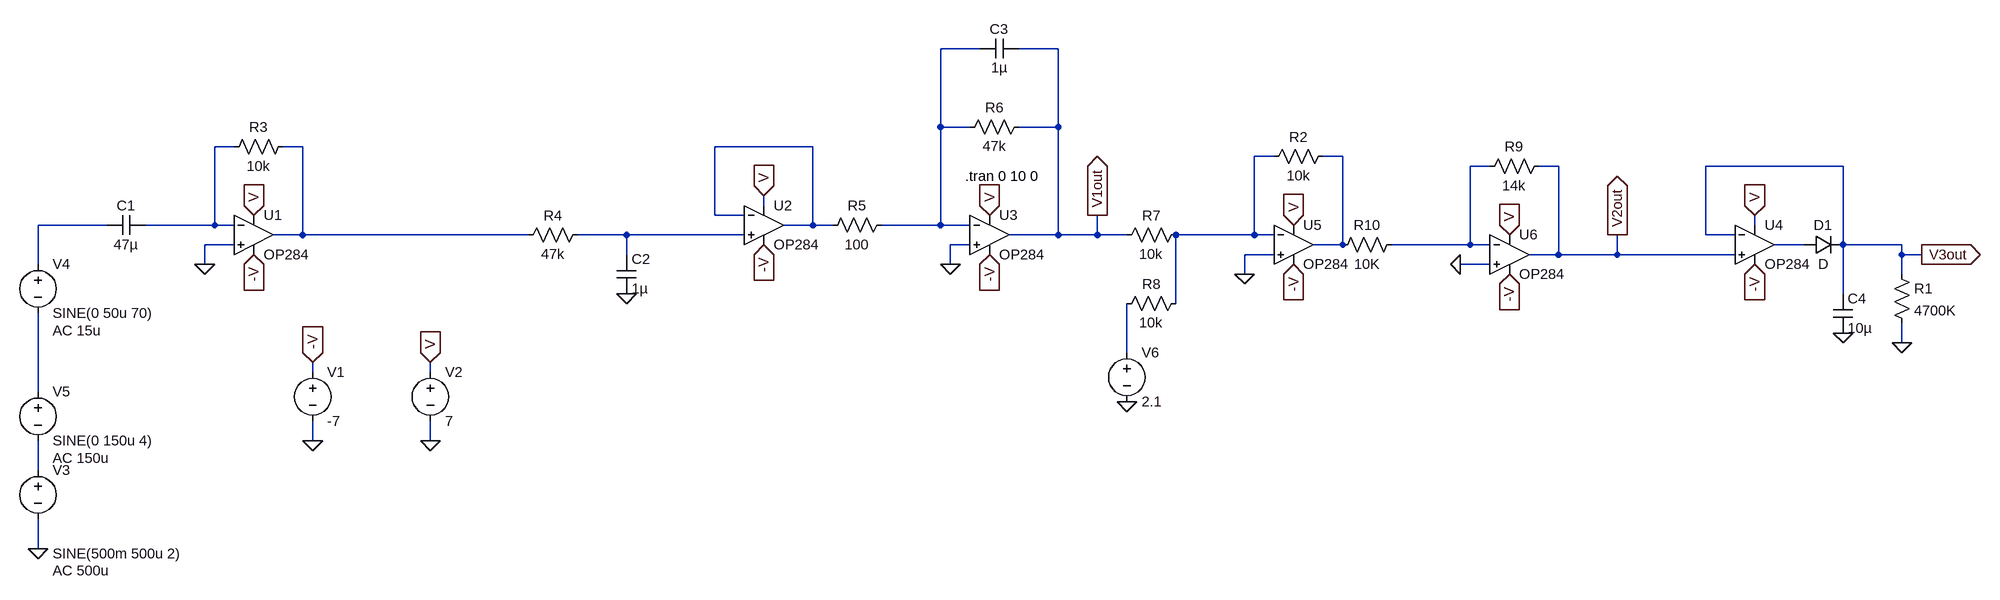
[diagram p0: schematic PPG.asc]
PPG.asc, the LTspice schematic file:
Version 4
SHEET 1 3920 992
WIRE 1440 -160 1376 -160
WIRE 1568 -160 1504 -160
WIRE 1376 -32 1376 -160
WIRE 1424 -32 1376 -32
WIRE 1568 -32 1568 -160
WIRE 1568 -32 1504 -32
WIRE 224 0 192 0
WIRE 336 0 304 0
WIRE 1168 0 1008 0
WIRE 1920 16 1888 16
WIRE 2032 16 2000 16
WIRE 2272 32 2240 32
WIRE 2384 32 2352 32
WIRE 2848 32 2624 32
WIRE 1088 96 1088 80
WIRE 1008 112 1008 0
WIRE 1056 112 1008 112
WIRE 16 128 -96 128
WIRE 192 128 192 0
WIRE 192 128 80 128
WIRE 224 128 192 128
WIRE 1168 128 1168 0
WIRE 1168 128 1120 128
WIRE 1200 128 1168 128
WIRE 1376 128 1376 -32
WIRE 1376 128 1280 128
WIRE 1424 128 1376 128
WIRE 2704 128 2704 112
WIRE 336 144 336 0
WIRE 336 144 288 144
WIRE 704 144 336 144
WIRE 864 144 784 144
WIRE 1056 144 864 144
WIRE 1568 144 1568 -32
WIRE 1568 144 1488 144
WIRE 1632 144 1632 112
WIRE 1632 144 1568 144
WIRE 1680 144 1632 144
WIRE 1888 144 1888 16
WIRE 1888 144 1760 144
WIRE 1920 144 1888 144
WIRE 2624 144 2624 32
WIRE 2672 144 2624 144
WIRE 224 160 176 160
WIRE 1424 160 1392 160
WIRE 2032 160 2032 16
WIRE 2032 160 1984 160
WIRE 2240 160 2240 32
WIRE 2240 160 2112 160
WIRE 2272 160 2240 160
WIRE 2784 160 2736 160
WIRE 2848 160 2848 32
WIRE 2944 160 2848 160
WIRE 864 176 864 144
WIRE 1920 176 1872 176
WIRE 2384 176 2384 32
WIRE 2384 176 2336 176
WIRE 2480 176 2480 144
WIRE 2480 176 2384 176
WIRE 2672 176 2480 176
WIRE 2944 176 2944 160
WIRE 2976 176 2944 176
WIRE -96 192 -96 128
WIRE 176 192 176 160
WIRE 1392 192 1392 160
WIRE 2272 192 2224 192
WIRE 1872 208 1872 176
WIRE 2944 208 2944 176
WIRE 2848 240 2848 160
WIRE 1760 256 1760 144
WIRE 2944 320 2944 288
WIRE 1680 336 1680 256
WIRE 352 368 352 352
WIRE 544 368 544 352
WIRE -96 400 -96 272
WIRE 352 480 352 448
WIRE 544 480 544 448
WIRE -96 528 -96 480
WIRE -96 656 -96 608
FLAG 176 192 0
FLAG 1088 80 V
IOPIN 1088 80 In
FLAG 1456 112 V
IOPIN 1456 112 In
FLAG 256 112 V
IOPIN 256 112 In
FLAG 1088 160 -V
IOPIN 1088 160 In
FLAG 1456 176 -V
IOPIN 1456 176 In
FLAG 256 176 -V
IOPIN 256 176 In
FLAG 352 480 0
FLAG 544 480 0
FLAG 544 352 V
IOPIN 544 352 In
FLAG 352 352 -V
IOPIN 352 352 In
FLAG -96 656 0
FLAG 864 240 0
FLAG 2704 112 V
IOPIN 2704 112 In
FLAG 2704 192 -V
IOPIN 2704 192 In
FLAG 2848 304 0
FLAG 2944 320 0
FLAG 1392 192 0
FLAG 1872 208 0
FLAG 1952 128 V
IOPIN 1952 128 In
FLAG 1952 192 -V
IOPIN 1952 192 In
FLAG 1680 416 0
FLAG 2304 144 V
IOPIN 2304 144 In
FLAG 2304 208 -V
IOPIN 2304 208 In
FLAG 2224 192 0
FLAG 1632 112 V1out
IOPIN 1632 112 Out
FLAG 2480 144 V2out
IOPIN 2480 144 Out
FLAG 2976 176 V3out
IOPIN 2976 176 Out
SYMBOL cap 80 112 R90
WINDOW 0 0 32 VBottom 2
WINDOW 3 32 32 VTop 2
SYMATTR InstName C1
SYMATTR Value 47µ
SYMBOL OpAmps\\OP284 256 80 R0
SYMATTR InstName U1
SYMBOL res 320 -16 R90
WINDOW 0 0 56 VBottom 2
WINDOW 3 32 56 VTop 2
SYMATTR InstName R3
SYMATTR Value 10k
SYMBOL res 800 128 R90
WINDOW 0 0 56 VBottom 2
WINDOW 3 32 56 VTop 2
SYMATTR InstName R4
SYMATTR Value 47k
SYMBOL cap 848 176 R0
SYMATTR InstName C2
SYMATTR Value 1µ
SYMBOL OpAmps\\OP284 1088 64 R0
SYMATTR InstName U2
SYMBOL res 1296 112 R90
WINDOW 0 0 56 VBottom 2
WINDOW 3 32 56 VTop 2
SYMATTR InstName R5
SYMATTR Value 100
SYMBOL OpAmps\\OP284 1456 80 R0
SYMATTR InstName U3
SYMBOL res 1520 -48 R90
WINDOW 0 0 56 VBottom 2
WINDOW 3 32 56 VTop 2
SYMATTR InstName R6
SYMATTR Value 47k
SYMBOL cap 1504 -176 R90
WINDOW 0 0 32 VBottom 2
WINDOW 3 32 32 VTop 2
SYMATTR InstName C3
SYMATTR Value 1µ
SYMBOL voltage 352 352 R0
WINDOW 123 0 0 Left 0
WINDOW 39 0 0 Left 0
SYMATTR InstName V1
SYMATTR Value -7
SYMBOL voltage 544 352 R0
WINDOW 123 0 0 Left 0
WINDOW 39 0 0 Left 0
SYMATTR InstName V2
SYMATTR Value 7
SYMBOL voltage -96 512 R0
WINDOW 3 24 152 Left 2
WINDOW 123 24 180 Left 2
WINDOW 39 0 0 Left 0
SYMATTR Value SINE(500m 500u 2)
SYMATTR Value2 AC 500u
SYMATTR InstName V3
SYMBOL voltage -96 176 R0
WINDOW 123 24 124 Left 2
WINDOW 39 0 0 Left 0
SYMATTR Value2 AC 15u
SYMATTR InstName V4
SYMATTR Value SINE(0 50u 70)
SYMBOL voltage -96 384 R0
WINDOW 123 24 124 Left 2
WINDOW 39 0 0 Left 0
SYMATTR Value2 AC 150u
SYMATTR InstName V5
SYMATTR Value SINE(0 150u 4)
SYMBOL OpAmps\\OP284 2704 96 R0
SYMATTR InstName U4
SYMBOL diode 2784 176 R270
WINDOW 0 32 32 VTop 2
WINDOW 3 0 32 VBottom 2
SYMATTR InstName D1
SYMBOL cap 2832 240 R0
SYMATTR InstName C4
SYMATTR Value 10µ
SYMBOL res 2928 192 R0
SYMATTR InstName R1
SYMATTR Value 4700K
SYMBOL OpAmps\\OP284 1952 96 R0
SYMATTR InstName U5
SYMBOL res 2016 0 R90
WINDOW 0 0 56 VBottom 2
WINDOW 3 32 56 VTop 2
SYMATTR InstName R2
SYMATTR Value 10k
SYMBOL res 1664 160 R270
WINDOW 0 32 56 VTop 2
WINDOW 3 0 56 VBottom 2
SYMATTR InstName R7
SYMATTR Value 10k
SYMBOL res 1664 272 R270
WINDOW 0 32 56 VTop 2
WINDOW 3 0 56 VBottom 2
SYMATTR InstName R8
SYMATTR Value 10k
SYMBOL voltage 1680 320 R0
WINDOW 123 0 0 Left 0
WINDOW 39 0 0 Left 0
SYMATTR InstName V6
SYMATTR Value 2.1
SYMBOL OpAmps\\OP284 2304 112 R0
SYMATTR InstName U6
SYMBOL res 2368 16 R90
WINDOW 0 0 56 VBottom 2
WINDOW 3 32 56 VTop 2
SYMATTR InstName R9
SYMATTR Value 14k
SYMBOL res 2016 176 R270
WINDOW 0 32 56 VTop 2
WINDOW 3 0 56 VBottom 2
SYMATTR InstName R10
SYMATTR Value 10K
TEXT 1416 48 Left 2 !.tran 0 10 0

The netlist it stands for:
* PPG.asc
C1 N002 N008 47µ
XU1 0 N002 V -V N003 OP284  ; pins In+ In- V+ V- OUT
R3 N003 N002 10k
R4 N009 N003 47k
C2 N009 0 1µ
XU2 N009 N004 V -V N004 OP284  ; pins In+ In- V+ V- OUT
R5 N001 N004 100
XU3 0 N001 V -V V1out OP284  ; pins In+ In- V+ V- OUT
R6 V1out N001 47k
C3 V1out N001 1µ
V1 -V 0 -7
V2 V 0 7
V3 N013 0 SINE(500m 500u 2) AC 500u
V4 N008 N012 SINE(0 50u 70) AC 15u
V5 N012 N013 SINE(0 150u 4) AC 150u
XU4 V2out V3out V -V N010 OP284  ; pins In+ In- V+ V- OUT
D1 N010 V3out D
C4 V3out 0 10µ
R1 V3out 0 4700K
XU5 0 N005 V -V N006 OP284  ; pins In+ In- V+ V- OUT
R2 N006 N005 10k
R7 V1out N005 10k
R8 N011 N005 10k
V6 N011 0 2.1
XU6 0 N007 V -V V2out OP284  ; pins In+ In- V+ V- OUT
R9 V2out N007 14k
R10 N006 N007 10K
.model D D
.lib standard.dio
.tran 0 10 0
.lib ADI1.lib
.backanno
.end